# EAGLE design Spica_1_1 (EAGLE 9.2.2)
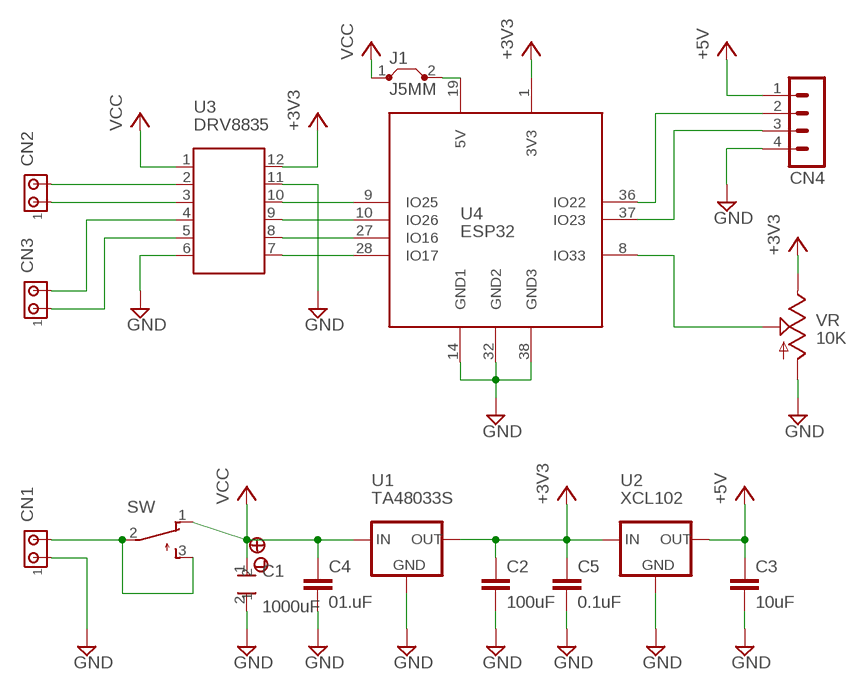
[diagram p0: schematic, sheet 1]

## Parts
C1  1000uF  ELECTROLYTIC_CAPACITOR_LARGE  [ELECTROLYTIC_CAPACITOR_LARGE]
C2  100uF  C2.5/5  [C2.5-5]
C3  10uF  C2.5/5  [C2.5-5]
C4  01.uF  C2.5/2  [C2.5-2]
C5  0.1uF  C2.5/2  [C2.5-2]
CN1  MTA02-100  [10X02MTA]
CN2  MTA02-100  [10X02MTA]
CN3  MTA02-100  [10X02MTA]
CN4  MA04-1  [MA04-1]
J1  J5MM  [05]
SW  TL32PO  [TL3XPO]
U1  TA48033S  78XXS  [78XXS]
U2  XCL102  78XXS  [78XXS]
U3  DRV8835  [DRV8835]
U4  ESP32  [ESP32]
VR  10K  TRIM_US-CA6V  [CA6V]

## Nets
+3V3: C2.1 C5.1 U1.OUT U2.IN U3.12 U4.1(3V3) VR.E
+5V: C3.1 CN4.1 U2.OUT
GND: C1.2 C2.2 C3.2 C4.2 C5.2 CN1.1 CN4.4 U1.GND U2.GND U3.6 U3.11 U4.14(GND1) U4.32(GND2) U4.38(GND3) VR.A
N$2: CN3.2 U3.4
N$3: CN3.1 U3.5
N$4: U3.10 U4.9(IO25)
N$5: CN2.1 U3.3
N$6: CN2.2 U3.2
N$8: U3.9 U4.10(IO26)
N$9: U3.8 U4.27(IO16)
N$10: U3.7 U4.28(IO17)
N$11: CN4.2 U4.36(IO22)
N$12: CN4.3 U4.37(IO23)
N$13: U4.8(IO33) VR.S
N$14: J1.2 U4.19(5V)
VCC: C1.1 C4.1 J1.1 SW.1(O) U1.IN U3.1
VIN: CN1.2 SW.2(P) SW.3(S)

## Library data of the parts
C1 = capacitor:ELECTROLYTIC_CAPACITOR_LARGE: electrolytic_capacitor_LARGE
C2-C5 = capacitor-wima:C: CAPACITOR naming: grid - package width
CN1-CN3 = con-amp:MTA02-100: AMP connector
CN4 = con-lstb:MA04-1: PIN HEADER; OC_FARNELL: unknown; OC_NEWARK: unknown
J1 = jumper:J: Bridge
SW = switch:TL32PO: TINY SWITCH ON - MOM Source: http://www2.produktinfo.conrad.com/datenblaetter/700000-724999/705152-da-01-de-Subminiaturschalter_TL_36YO.pdf
U1 U2 = v-reg:78XXS: VOLTAGE REGULATOR
U3 = DRV8835:DRV8835: DRV8835
U4 = ESP32:ESP32: ESP32
VR = pot:TRIM_US-: POTENTIOMETER

## Net classes
0 default: width 1.27 mm, drill 1.27 mm, clearance 0.635 mm

## Board
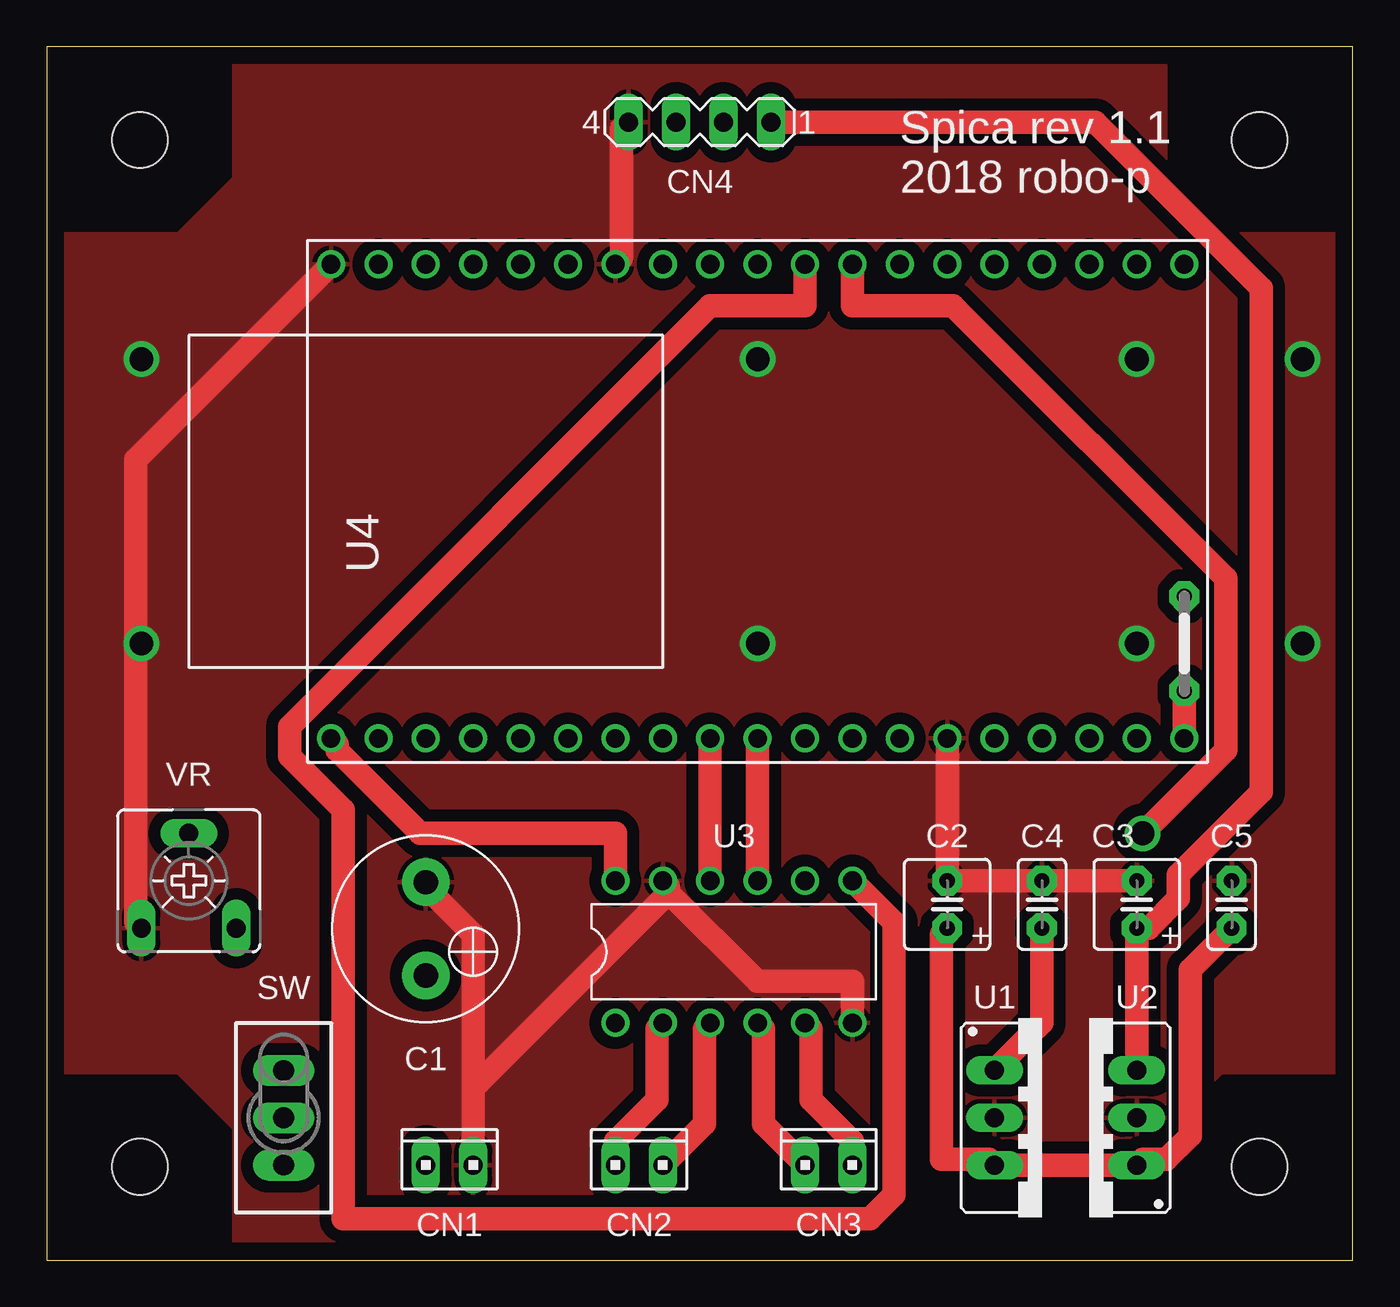
[diagram p1: board, top side]
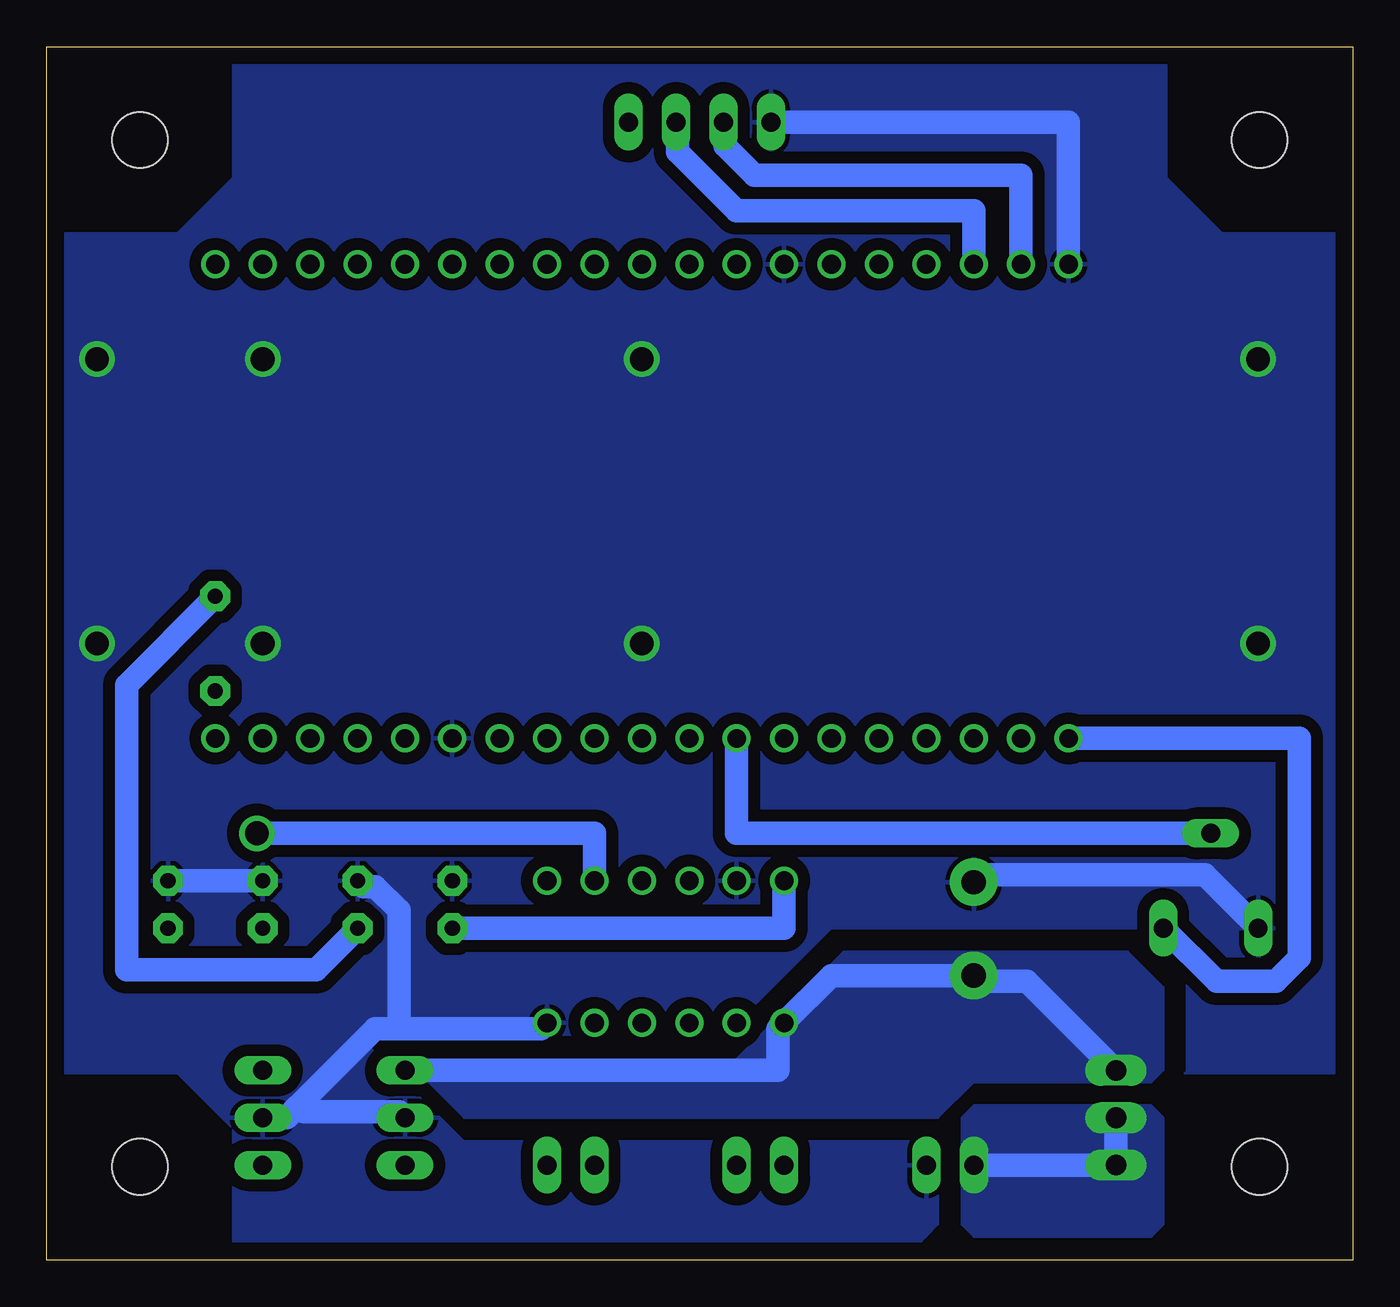
[diagram p2: board, bottom side, seen from below]

Size 70 x 65 mm. Coordinates in mm from the lower left corner, seen from the top.
Outline: 0,0 70,0 70,65 0,65 0,0
Copper layers (1*16): Top 0.035mm / dielectric 1.53mm / Bottom 0.035mm
Design rules "pban_5mil-l2": minimum track width 5mil, minimum drill 0.3mm, track to track 5mil, track to pad 0.229mm, pad to pad 5mil, via to via 5mil, smd to smd 5mil, copper to edge 0.5mm, drill to drill 0.5mm, minimum pad ring 0.15mm, minimum via ring 0.15mm, stop-mask expansion 4mil, vias tented up to drill 0.35mm, thermal gap 10mil
Holes 3 mm at 5,5 5,60 65,5 65,60

### Footprints (pad centres in the part's own frame; a part is rotated, then mirrored left to right if it is on the bottom)
ELECTROLYTIC_CAPACITOR_LARGE = drill 1.3 pad 2.54: 1 0,0; 2 0,5
C2.5-5 = drill 0.813 pad 1.6 octagon: 1 -1.27,0; 2 1.27,0
C2.5-2 = drill 0.813 pad 1.6 octagon: 1 -1.27,0; 2 1.27,0
10X02MTA = drill 1.016 long: 1 1.27,0; 2 -1.27,0
MA04-1 = drill 1.016 long: 1 -3.81,0; 2 -1.27,0; 3 1.27,0; 4 3.81,0
05 = drill 0.813 pad 1.6 octagon: 1 -2.54,0; 2 2.54,0
TL3XPO = drill 1.1 pad 1.422 long: 1 -2.54,0; 2 0,0; 3 2.54,0
78XXS = drill 1.016 long: GND 0,-2.54; IN -2.54,-2.54; OUT 2.54,-2.54
DRV8835 = drill 1: 1 -3.81,6.35; 2 -3.81,3.81; 3 -3.81,1.27; 4 -3.81,-1.27; 5 -3.81,-3.81; 6 -3.81,-6.35; 7 3.81,-6.35; 8 3.81,-3.81; 9 3.81,-1.27; 10 3.81,1.27; 11 3.81,3.81; 12 3.81,6.35
ESP32 = drill 1: 1 -12.7,22.86; 2 -12.7,20.32; 3 -12.7,17.78; 4 -12.7,15.24; 5 -12.7,12.7; 6 -12.7,10.16; 7 -12.7,7.62; 8 -12.7,5.08; 9 -12.7,2.54; 10 -12.7,0; 11 -12.7,-2.54; 12 -12.7,-5.08; 13 -12.7,-7.62; 14 -12.7,-10.16; 15 -12.7,-12.7; 16 -12.7,-15.24; 17 -12.7,-17.78; 18 -12.7,-20.32; 19 -12.7,-22.86; 20 12.7,-22.86; 21 12.7,-20.32; 22 12.7,-17.78; 23 12.7,-15.24; 24 12.7,-12.7; 25 12.7,-10.16; 26 12.7,-7.62; 27 12.7,-5.08; 28 12.7,-2.54; 29 12.7,0; 30 12.7,2.54; 31 12.7,5.08; 32 12.7,7.62; 33 12.7,10.16; 34 12.7,12.7; 35 12.7,15.24; 36 12.7,17.78; 37 12.7,20.32; 38 12.7,22.86
CA6V = drill 1.016 long: A -2.54,-2.54; E 2.54,-2.54; S 0,2.54

### Placement (x,y rotation side)
C1  20.32,15.24 0 top
C2  48.26,19.05 90 top
C3  58.42,19.05 90 top
C4  53.34,19.05 90 top
C5  63.5,19.05 90 top
CN1  21.59,5.08 0 top
CN2  31.75,5.08 0 top
CN3  41.91,5.08 0 top
CN4  35,60.96 180 top
J1  60.96,33.02 270 top
SW  12.7,7.62 270 top
U1  53.34,7.62 270 top
U2  55.88,7.62 90 top
U3  36.83,16.51 90 top
U4  38.1,40.64 90 top
VR  7.62,20.32 0 top

### Tracks (layer width: path | path; a pad name or v marks a point on that pad's centre or on a via)
+3V3
  Top 1.27: C5.1 61.28,15.56 61.28,6.67 60.01,5.4 58.74,5.4 U2.IN U1.OUT 50.48,5.4 47.94,5.4 47.94,17.46 C2.1 | U4.1 15.56,27.62 15.56,27.3 20,22.86 30.48,22.86 U3.12
  Bottom 1.27: U3.12 30.48,17.78 C2.1 | VR.E 7.3,14.92 4.13,14.92 2.86,16.19 2.86,27.94 U4.1
+5V
  Top 1.27: U2.OUT C3.1 59.05,17.78 60.64,19.37 60.64,20.64 65.09,25.08 65.09,52.07 56.2,60.96 CN4.1
GND  (via drill 1.27)
  Top 1.27: U4.14 C2.2 C4.2 C3.2 | U3.11 33.34,20 33.34,19.68 | 33.34,19.68 38.1,14.92 43.18,14.92 U3.6 | U4.32 30.8,53.66 30.8,60.64 31.11,60.96 CN4.4 | 22.86,9.53 22.86,17.46 20.32,20 C1.2 | 22.86,9.53 CN1.1 | U4.38 4.76,42.86 4.76,18.1 VR.A | 33.34,19.68 23.18,9.53 22.86,9.53
  Bottom 1.27: C3.2 C5.2 | U3.6 43.5,12.38 51.12,12.38 | 51.12,12.38 52.39,12.38 56.52,8.26 | 56.52,8.26 57.15,7.62 U2.GND | U1.GND 51.12,7.94 56.2,7.94 56.52,8.26 | C4.2 53.02,20 52.39,20 51.12,18.73 51.12,12.38 | U4.38 15.24,60.96 CN4.4 | VR.A 7.94,20.64 20,20.64 20.32,20.32 C1.2
  other vias: 58.42,48.26 5.08,33.02 5.08,48.26 58.42,33.02 67.31,48.26 67.31,33.02 38.1,48.26 38.1,33.02
  pour Top: 10,64 60,64 60,58 63,55 69,55 69,10 63,10 60,7 60,1 10,1 10,7 7,10 1,10 1,55 7,55 10,58
  pour Bottom: 22.86,1.27 22.23,1.91 22.23,6.35 47.62,6.35 52.7,11.43 52.07,12.06 33.66,12.06 27.94,17.78 27.94,20.95 27.94,21.59 28.35,22 69,22 69,10 63,10 60,7 60,1 23.77,1 23.13,1
  pour Bottom: 10,64 60,64 60,58 63,55 69,55 69,21 28.62,21 28.57,20.95 28.57,17.78 10.16,17.78 8.89,16.51 8.89,10.11 9,10 1,10 1,55 7,55 10,58
N$2
  Top 1.27: U3.4 38.42,12.38 38.42,7.3 CN3.2
N$3
  Top 1.27: U3.5 40.96,12.38 40.96,8.57 43.18,6.35 CN3.1
N$4
  Top 1.27: U4.9 U3.10
N$5
  Top 1.27: U3.3 35.24,12.38 35.24,7.3 CN2.1
N$6
  Top 1.27: U3.2 32.7,12.38 32.7,8.57 30.48,6.35 CN2.2
N$8
  Top 1.27: U4.10 U3.9
N$9  (via drill 1.27)
  Top 1.27: v58.74,22.86 63.18,27.3 63.18,36.51 48.58,51.12 43.18,51.12 U4.27
  Bottom 1.27: U3.8 40.64,22.86 v58.74,22.86
N$10
  Top 1.27: U3.7 45.4,18.1 45.4,3.49 44.13,2.22 15.88,2.22 15.88,24.13 13.02,26.99 13.02,28.57 35.56,51.12 40.64,51.12 U4.28
N$11
  Bottom 1.27: U4.36 20.32,56.2 33.02,56.2 36.2,59.37 36.2,60.96 CN4.2
N$12
  Bottom 1.27: U4.37 17.78,58.1 32.07,58.1 33.66,59.69 33.66,60.96 CN4.3
N$13
  Bottom 1.27: U4.8 33.02,22.86 VR.S
N$14
  Top 1.27: J1.2 U4.19
VCC
  Top 1.27: U1.IN 53.34,12.7 C4.1
  Bottom 1.27: SW.1 17.46,14.92 20,14.92 C1.1 27.94,15.24 U3.1 30.8,12.38 30.8,10.16 U1.IN | J1.1 65.72,30.8 65.72,15.56 55.56,15.56 C4.1
  pour Bottom (no thermals): 10.79,9.53 20.32,9.53 22.23,7.62 47.62,7.62 49.53,9.53 49.53,10.16 33.66,10.16 27.3,16.51 12.06,16.51 10.16,14.61 10.16,10.16
VIN
  Bottom 1.27: CN1.2 SW.3 SW.2
  pour Bottom (no thermals): 10.79,8.26 20.32,8.26 20.95,7.62 20.95,1.91 20.32,1.27 10.79,1.27 10.16,1.91 10.16,7.62

### Text on the board
tNames: Spica rev 1.1 / 2018 robo-p | + | + | C1